# Altium project PCB_Project1.PrjPCB
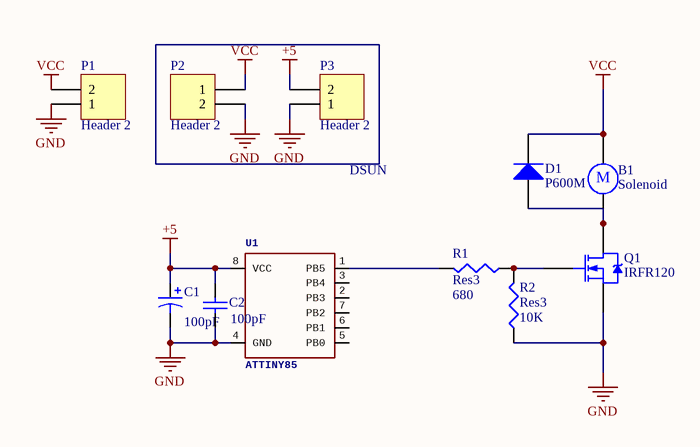
[diagram p0: Sheet1.SchDoc]
1 sheet, 11 parts. Net scope: global (net labels, ports and power ports of the same name join across sheets).
Board file: solenoid_driver.PcbDoc

## Sheet Sheet1.SchDoc
size A

### Parts
B1  Solenoid  [RB5-10.5]
C1  value 100pF  [C0805]
C2  value 100pF  [C1206]
D1  P600M  [SMC]
P1  Header 2  [HDR1X2]
P2  Header 2  [HDR1X2]
P3  Header 2  [HDR1X2]
Q1  IRFR120  [TO-220AB]
R1  Res3  value 680  [14-1210]
R2  Res3  value 10K  [14-1210]
U1  ATTINY85  [ATTINY85]

### Nets
+5: C1.1 C2.1 P3.2 U1.8(VCC)
GND: C1.2 C2.2 P1.1 P2.2 P3.1 Q1.3(S) R2.1 U1.4(GND)
VCC: B1.1 D1.2(K) P1.2 P2.1
NetB1_2: B1.2 D1.1(A) Q1.2(D)
NetQ1_1: Q1.1(G) R1.1 R2.2
NetR1_2: R1.2 U1.1(PB5)

Not connected (* = marked no-connect by the designer): U1 2(PB3) 3(PB4) 5(PB0) 6(PB1) 7(PB2)

### Notes on the sheet
- DSUN
- (in symbol Motor) M

### Library data of the parts
B1 = Motor: Motor, General Kind; Published: 24-Mar-1999; LatestRevisionDate: 17-Jul-2002; LatestRevisionNote: Re-released for DXP Platform.; PackageReference: RB5-10.5; Publisher: Altium Limited; PackageDescription: Capacitor (Radial); 2 Leads
C1 = Cap Pol3: Polarized Capacitor (Surface Mount); Published: 8-Jun-2000; LatestRevisionDate: 29-May-2009; LatestRevisionNote: IPC-7351 Footprint Added.; PackageReference: C0805; Publisher: Altium Limited; PackageDescription: Chip Capacitor
C2 = Cap Semi: Capacitor (Semiconductor SIM Model); Published: 8-Jun-2000; LatestRevisionDate: 29-May-2009; LatestRevisionNote: IPC-7351 Footprint Added.; PackageReference: C1206; Publisher: Altium Limited; PackageDescription: Chip Capacitor
D1 = Diode: Default Diode; Published: 8-Jun-2000; LatestRevisionDate: 17-Jul-2002; LatestRevisionNote: Re-released for DXP Platform.; PackageVersion: Sep-1996; PackageReference: SMC; Publisher: Altium Limited; PackageDescription: DO-214-AB/SMC; 2 C-Bend Leads; Body 7.9 x 5.9 mm, inc. leads (LxW); Code_JEDEC: DO-214-AB
P1-P3 = Header 2: Header, 2-Pin; LatestRevisionDate: 17-Jul-2002; LatestRevisionNote: Re-released for DXP Platform.; Publisher: Altium Limited
Q1 = NMOS-2: N-Channel Power MOSFET; Note: Pin 2 is electrically connected to pin 4.; Published: 8-Jun-2000; LatestRevisionDate: 17-Jul-2002; LatestRevisionNote: Re-released for DXP Platform.; DatasheetVersion: PD-9.814; PackageVersion: Feb-1997; PackageReference: TO-220AB; Publisher: Altium Limited; PackageDescription: TO, Thru-Hole, Vertical, Heatsink Mounted; 3 In-Line Leads; Pitch 2.54 mm; ComponentLink1Description: Manufacturer Link; ComponentLink1URL: http://www.irf.com/
R1 R2 = Res3: Resistor; Published: 8-Jun-2000; LatestRevisionDate: 29-May-2009; LatestRevisionNote: IPC-7351 Footprint Added.; PackageReference: J1-0603; Publisher: Altium Limited; PackageDescription: Chip Resistor
U1 = ATTINY85: GateName_1: U1; SymbolName_1: ATTINY85_ATTINY85; PROD_ID: IC-09092; LibraryName: SparkFun-IC-Microcontroller; DeviceSetName: ATTINY85; Package: ATTINY85